# EAGLE design Thrusters(terminals) pcb (EAGLE 9.5.1)
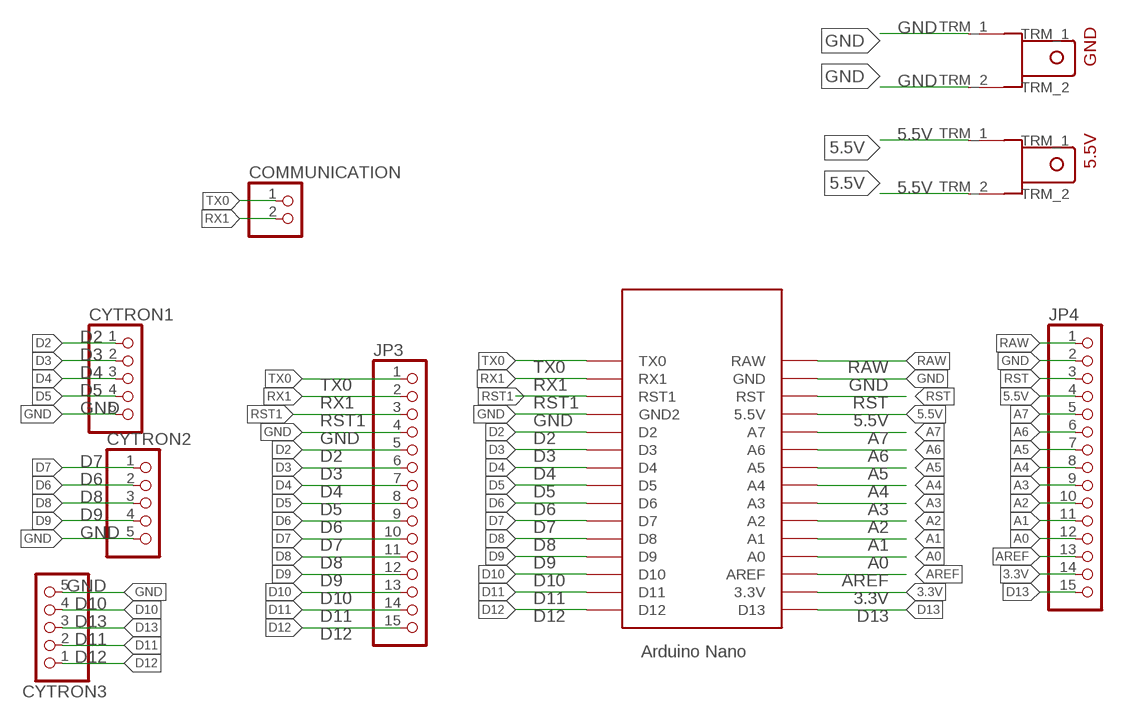
[diagram p0: schematic, sheet 1]

## Parts
5.5V  TERMINAL_EDITED  [TERMINAL_EDITED]
COMMUNICATION  PINHD-2_DATA  [1X02_DATA]
CYTRON1  PINHD-5_DATA  [1X05_DATA]
CYTRON2  PINHD-5_DATA  [1X05_DATA]
CYTRON3  PINHD-5_DATA  [1X05_DATA]
GND  TERMINAL_EDITED  [TERMINAL_EDITED]
JP3  PINHD-1X15  [1X15]
JP4  PINHD-1X15  [1X15]
U$1  ARDUINO_NANO  [NANO]

## Nets
3.3V: JP4.14 U$1.3.3V
5.5V: 5.5V.TRM_1 5.5V.TRM_2 JP4.4 U$1.5V(5.5V)
A0: JP4.12 U$1.A0
A1: JP4.11 U$1.A1
A2: JP4.10 U$1.A2
A3: JP4.9 U$1.A3
A4: JP4.8 U$1.A4
A5: JP4.7 U$1.A5
A6: JP4.6 U$1.A6
A7: JP4.5 U$1.A7
AREF: JP4.13 U$1.AREF
D2: CYTRON1.1 JP3.5 U$1.D2
D3: CYTRON1.2 JP3.6 U$1.D3
D4: CYTRON1.3 JP3.7 U$1.D4
D5: CYTRON1.4 JP3.8 U$1.D5
D6: CYTRON2.2 JP3.9 U$1.D6
D7: CYTRON2.1 JP3.10 U$1.D7
D8: CYTRON2.3 JP3.11 U$1.D8
D9: CYTRON2.4 JP3.12 U$1.D9
D10: CYTRON3.4 JP3.13 U$1.D10
D11: CYTRON3.2 JP3.14 U$1.D11
D12: CYTRON3.1 JP3.15 U$1.D12
D13: CYTRON3.3 JP4.15 U$1.D13
GND: CYTRON1.5 CYTRON2.5 CYTRON3.5 GND.TRM_1 GND.TRM_2 JP3.4 JP4.2 U$1.GND U$1.GND1(GND2)
RAW: JP4.1 U$1.RAW
RST: JP4.3 U$1.RST
RST1: JP3.3 U$1.RST1
RX1: COMMUNICATION.2 JP3.2 U$1.RX1
TX0: COMMUNICATION.1 JP3.1 U$1.TX0

## Library data of the parts
5.5V GND = MIA_LIBRARY-2-2-2:TERMINAL_EDITED
COMMUNICATION = MIA_LIBRARY-2-2-2:PINHD-2_DATA: PIN HEADER
CYTRON1-CYTRON3 = MIA_LIBRARY-2-2-2:PINHD-5_DATA: PIN HEADER
JP3 JP4 = MIA_LIBRARY-2-2-2:PINHD-1X15: PIN HEADER
U$1 = MIA-Training:ARDUINO_NANO: Arduino Nano

## Board
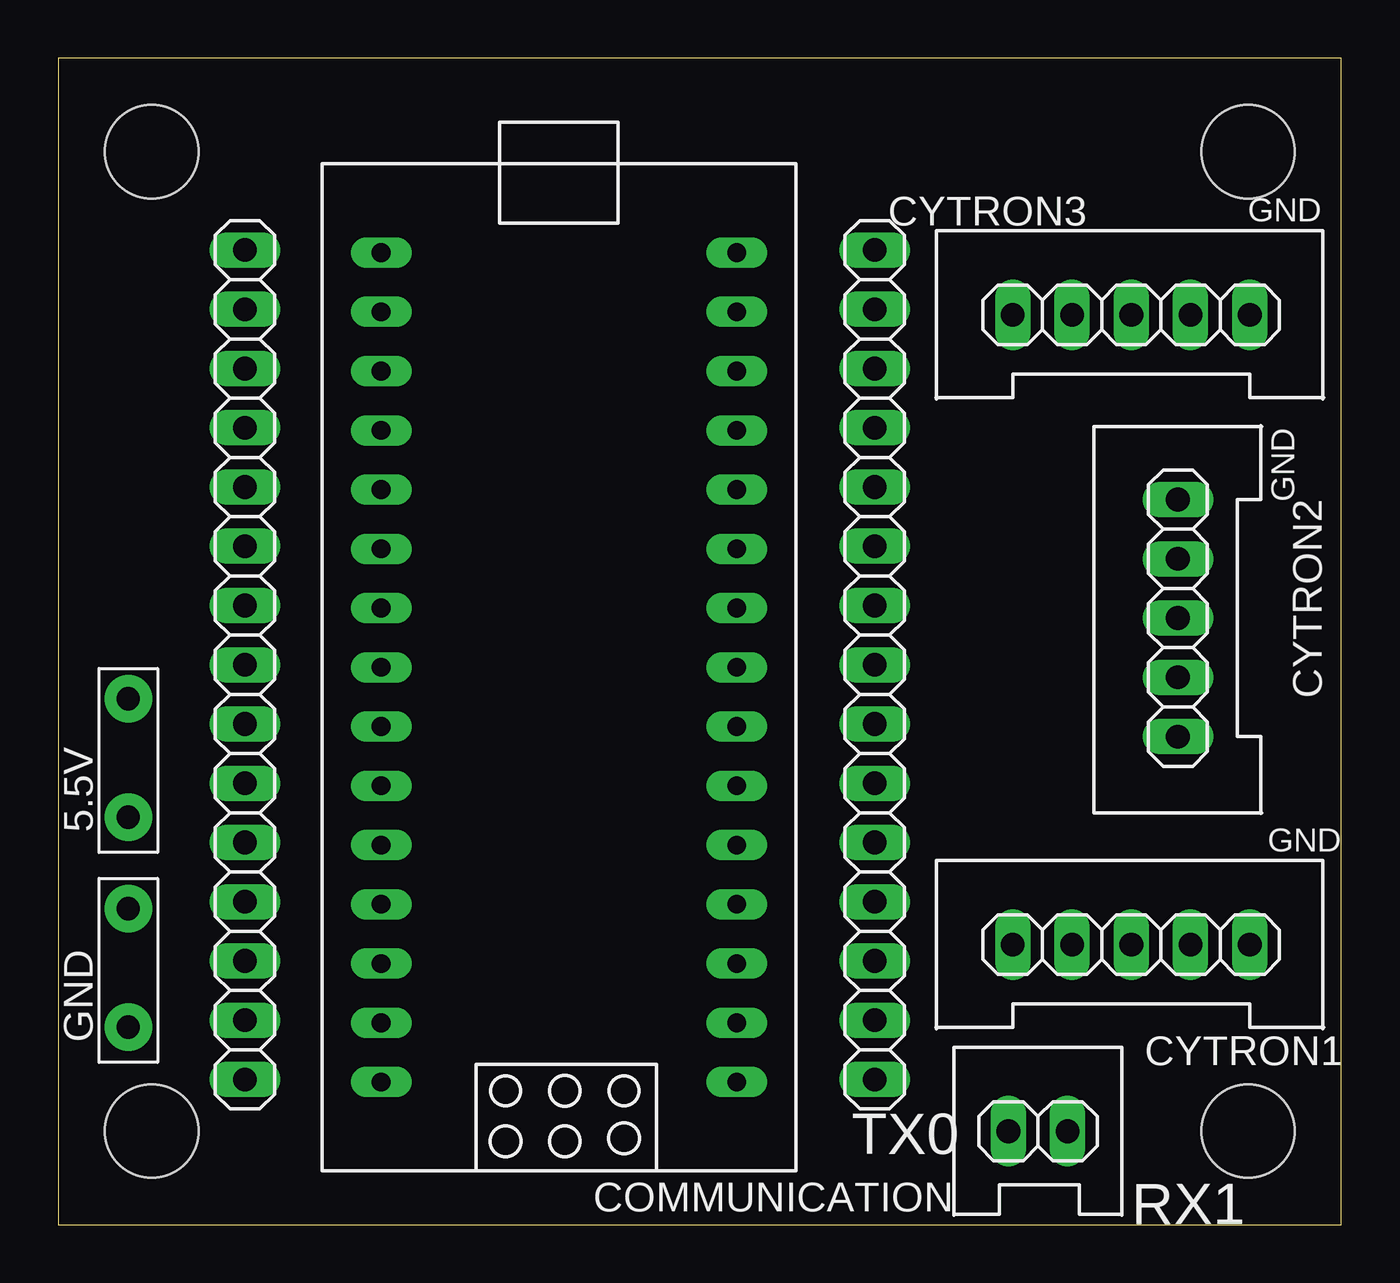
[diagram p1: board, top side]
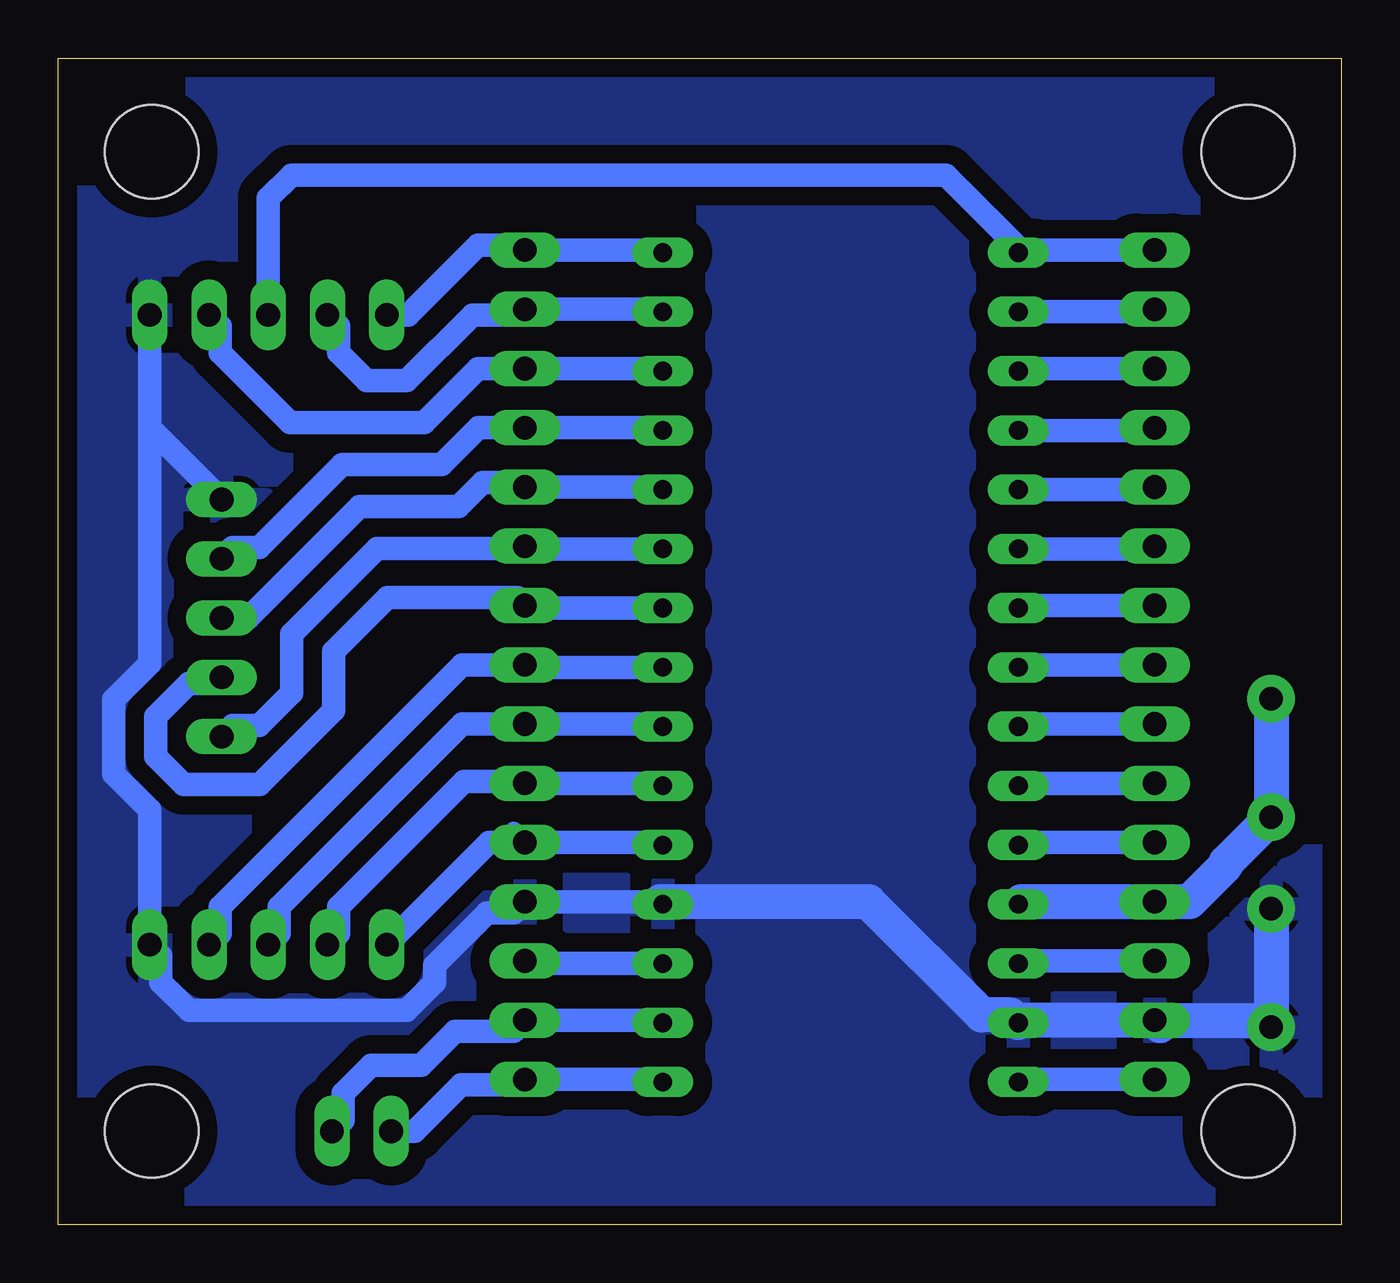
[diagram p2: board, bottom side, seen from below]

Size 55 x 50 mm. Coordinates in mm from the lower left corner, seen from the top.
Outline: 0,0 55,0 55,50 0,50 0,0
Copper layers (1*16): Top 0.035mm / dielectric 0.15mm / Bottom 0.035mm
Design rules "default *": minimum track width 0.8mm, minimum drill 0.35mm, track to track 0.8mm, track to pad 0.8mm, pad to pad 6mil, via to via 6mil, smd to smd 6mil, copper to edge 0.8mm, drill to drill 6mil, minimum pad ring 10mil, minimum via ring 8mil, stop-mask expansion 4mil, vias tented up to drill 0mil, thermal gap 10mil
Holes 4 mm at 51,46 4,46 4,4 51,4

### Footprints (pad centres in the part's own frame; a part is rotated, then mirrored left to right if it is on the bottom)
TERMINAL_EDITED = drill 1 pad 2.032: TRM_1 -2.54,0; TRM_2 2.54,0
1X02_DATA = drill 1.016 long: 1 -1.27,0; 2 1.27,0
1X05_DATA = drill 1.016 long: 1 -5.08,0; 2 -2.54,0; 3 0,0; 4 2.54,0; 5 5.08,0
1X15 = drill 1.016 long: 1 -17.78,0; 2 -15.24,0; 3 -12.7,0; 4 -10.16,0; 5 -7.62,0; 6 -5.08,0; 7 -2.54,0; 8 0,0; 9 2.54,0; 10 5.08,0; 11 7.62,0; 12 10.16,0; 13 12.7,0; 14 15.24,0; 15 17.78,0
NANO = drill 0.8 long: 3.3V -10.16,24.13; 5V -10.16,-1.27; A0 -10.16,19.05; A1 -10.16,16.51; A2 -10.16,13.97; A3 -10.16,11.43; A4 -10.16,8.89; A5 -10.16,6.35; A6 -10.16,3.81; A7 -10.16,1.27; AREF -10.16,21.59; D2 5.08,1.27; D3 5.08,3.81; D4 5.08,6.35; D5 5.08,8.89; D6 5.08,11.43; D7 5.08,13.97; D8 5.08,16.51; D9 5.08,19.05; D10 5.08,21.59; D11 5.08,24.13; D12 5.08,26.67; D13 -10.16,26.67; GND -10.16,-6.35; GND1 5.08,-1.27; RAW -10.16,-8.89; RST -10.16,-3.81; RST1 5.08,-3.81; RX1 5.08,-6.35; TX0 5.08,-8.89

### Placement (x,y rotation side)
5.5V  3,20 90 top
COMMUNICATION  42,4 0 top
CYTRON1  46,12 0 top
CYTRON2  48,26 90 top
CYTRON3  46,39 0 top
GND  3,11 90 top
JP3  35,24 90 top
JP4  8,24 90 top
U$1  24,15 0 top

### Tracks (layer width: path | path; a pad name or v marks a point on that pad's centre or on a via)
3.3V
  Bottom 0.8: JP4.14 8.11,39.13
  Bottom 1: 8.11,39.13 U$1.3.3V
5.5V
  Bottom 0.8: 13.73,13.84 U$1.5V
  Bottom 1.5: 13.73,13.84 JP4.4 6.51,13.84 4.93,15.42 4.93,15.53 5.5V.TRM_1 5.5V.TRM_2
A0
  Bottom 0.8: JP4.12 8.11,34.05
  Bottom 1: 8.11,34.05 U$1.A0
A1
  Bottom 0.8: JP4.11 8.11,31.51
  Bottom 1: 8.11,31.51 U$1.A1
A2
  Bottom 0.8: JP4.10 8.11,28.97
  Bottom 1: 8.11,28.97 U$1.A2
A3
  Bottom 0.8: 13.73,26.54 U$1.A3
  Bottom 1: JP4.9 13.73,26.54
A4
  Bottom 0.8: 13.73,24 U$1.A4
  Bottom 1: JP4.8 13.73,24
A5
  Bottom 0.8: 13.73,21.46 U$1.A5
  Bottom 1: JP4.7 13.73,21.46
A6
  Bottom 0.8: 13.73,18.92 U$1.A6
  Bottom 1: JP4.6 13.73,18.92
A7
  Bottom 0.8: 13.73,16.38 U$1.A7
  Bottom 1: JP4.5 13.73,16.38
AREF
  Bottom 0.8: 13.73,36.7 U$1.AREF
  Bottom 1: JP4.13 13.73,36.7
D2
  Bottom 0.8: 35.49,16.87 JP3.5 | 29.19,16.38 U$1.D2
  Bottom 1: 29.19,16.38 JP3.5 36.54,16.38 CYTRON1.1
D3
  Bottom 0.8: 35.08,19 JP3.6 | 29.19,18.92 U$1.D3
  Bottom 1: JP3.6 29.19,18.92 | CYTRON1.2 42.98,12.48 42.98,13.62 37.6,19 35.08,19
D4
  Bottom 0.8: 29.19,21.46 U$1.D4
  Bottom 1: 29.19,21.46 JP3.7 37.68,21.46 45.52,13.62 45.52,12.48 CYTRON1.3
D5
  Bottom 0.8: JP3.8 34.89,23.89
  Bottom 1: 34.89,23.89 U$1.D5 | CYTRON1.4 48.06,12.48 48.06,13.63 37.69,24 JP3.8
D6
  Bottom 0.8: 35.46,27 JP3.9 34.89,26.43
  Bottom 1: 34.89,26.43 U$1.D6 | CYTRON2.2 48.26,23.2 49.4,23.2 50.82,21.77 50.82,20.07 49.62,18.86 46.38,18.86 43.2,22.04 43.2,24.57 40.88,26.88 35.34,26.88 JP3.9
D7
  Bottom 0.8: JP3.10 34.89,28.97
  Bottom 1: U$1.D7 34.89,28.97 34.9,28.98 41.34,28.98 45,25.31 45,22.78 46.38,21.4 47.52,21.4 CYTRON2.1
D8
  Bottom 0.8: 29.19,31.62 U$1.D8
  Bottom 1: 29.19,31.62 JP3.11 35.18,31.8 36.8,31.8 37.83,30.78 42.08,30.78 46.86,26 CYTRON2.3
D9
  Bottom 0.8: 29.19,34.16 U$1.D9
  Bottom 1: 29.19,34.16 JP3.12 36.99,34.16 38.58,32.58 42.83,32.58 46.38,29.02 47.52,29.02 CYTRON2.4
D10
  Bottom 0.8: 29.19,36.7 U$1.D10
  Bottom 1: 29.19,36.7 JP3.13 37,36.7 39.32,34.38 45.05,34.38 48.06,37.38 48.06,38.52 CYTRON3.4
D11
  Bottom 0.8: 29.19,39.24 U$1.D11
  Bottom 1: 29.19,39.24 JP3.14 35.24,39 37.24,39 40.07,36.18 41.77,36.18 42.98,37.38 42.98,38.52 CYTRON3.2
D12
  Bottom 0.8: 29.19,41.78 U$1.D12
  Bottom 1: 29.19,41.78 JP3.15 35.22,42 37,42 40,39 CYTRON3.1
D13
  Bottom 0.8: 13.73,41.78 U$1.D13
  Bottom 1: JP4.15 13.73,41.78 16.95,45 45,45 46,44 CYTRON3.3
GND
  Bottom 0.8: 29.19,13.84 U$1.GND1
  Bottom 1: 29.19,13.84 JP3.4 35.48,13.36 36.62,13.36 38.86,11.12 38.86,10.38 40.07,9.18 49.39,9.18 50.6,10.38 50.6,11.52 CYTRON1.5 51.08,17.78 52.62,19.32 52.62,22.52 51.08,24.06 51.08,34.16 | CYTRON3.5 51.08,34.16 | 51.08,34.16 CYTRON2.5
  Bottom 1.5: JP4.2 13.73,8.76 U$1.GND 14.18,8.99 15.41,8.99 20.26,13.84 29.19,13.84 | GND.TRM_2 GND.TRM_1 3.3,8.76 JP4.2 | 7.77,8.53 JP4.2
  pour Bottom: 0,50 0,0 55,0 55,50
RAW
  Bottom 1: JP4.1 13.73,6.22 U$1.RAW
RST
  Bottom 0.8: 13.73,11.3 U$1.RST
  Bottom 1: JP4.3 13.73,11.3
RST1
  Bottom 0.8: JP3.3 34.89,11.19
  Bottom 1: 34.89,11.19 U$1.RST1
RX1
  Bottom 0.8: 29.19,8.76 U$1.RX1
  Bottom 1: 29.19,8.76 JP3.2 35.48,8.28 37.99,8.28 39.45,6.82 41.58,6.82 42.79,5.62 42.79,4.48 COMMUNICATION.2
TX0
  Bottom 0.8: 29.19,6.22 U$1.TX0
  Bottom 1: JP3.1 29.19,6.22 | 35.51,6.22 JP3.1 | COMMUNICATION.1 39.73,4 37.73,6 35.22,6 JP3.1

### Text on the board
tNames: GND | GND | GND | TX0 | RX1